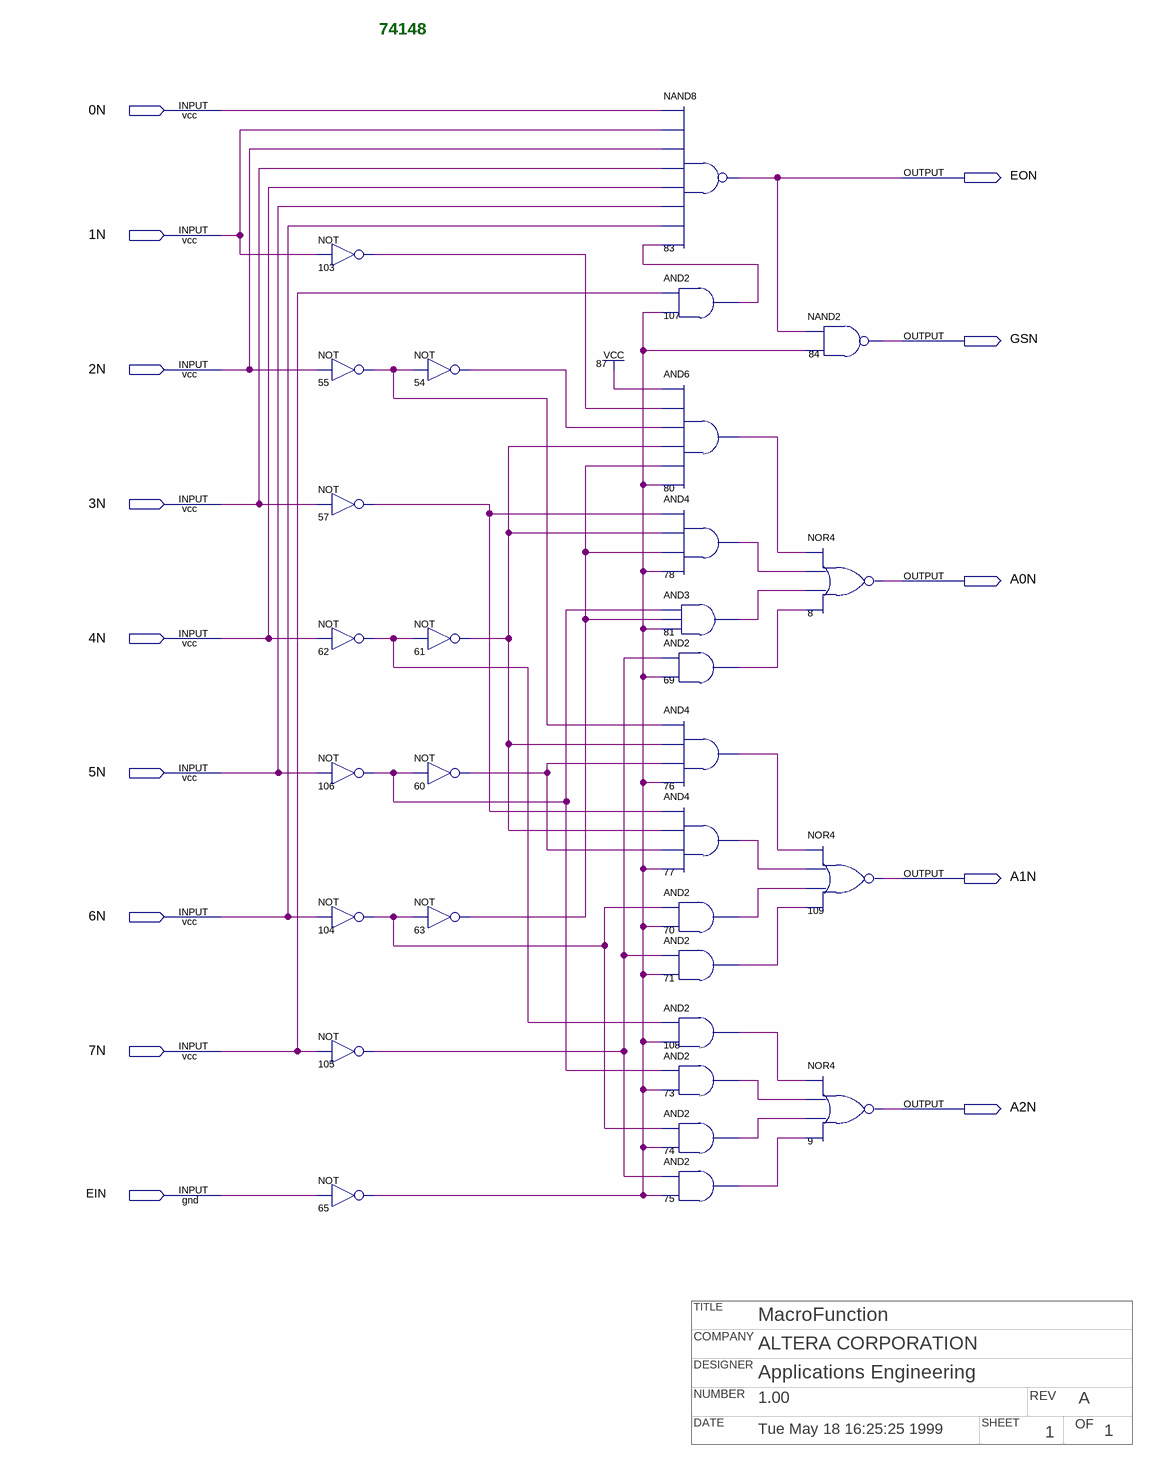
[diagram p0: schematic sheet]
// Quartus schematic 74148.bdf as structural Verilog: 30 symbols, 14 pins
// Title block: TITLE: MacroFunction; COMPANY: ALTERA CORPORATION; DESIGNER: Applications Engineering; NUMBER: 1.00; REV: A; DATE: Tue May 18 16:25:25 1999; SHEET: 1; OF: 1
module \74148  (
  input  \0N ,
  input  \1N ,
  input  \2N ,
  input  \3N ,
  input  \4N ,
  input  \5N ,
  input  \6N ,
  input  \7N ,
  input  EIN,
  output EON,
  output GSN,
  output A0N,
  output A1N,
  output A2N
);

  wire n54_out, n55_out, n57_out, n60_out, n61_out, n62_out, n63_out, n65_out, n69_out, n70_out, n71_out,
       n73_out, n74_out, n75_out, n76_out, n77_out, n78_out, n80_out, n81_out, n103_out, n104_out, n105_out,
       n106_out, n107_out, n108_out;

  not u_103 (n103_out, \1N );
  not u_55 (n55_out, \2N );
  not u_57 (n57_out, \3N );
  not u_62 (n62_out, \4N );
  not u_106 (n106_out, \5N );
  not u_104 (n104_out, \6N );
  not u_105 (n105_out, \7N );
  not u_65 (n65_out, EIN);
  not u_54 (n54_out, n55_out);
  not u_61 (n61_out, n62_out);
  not u_60 (n60_out, n106_out);
  not u_63 (n63_out, n104_out);
  nand u_83 (EON, \0N , \1N , \2N , \3N , \4N , \5N , \6N , n107_out);
  and u_107 (n107_out, \7N , n65_out);
  and u_80 (n80_out, 1'b1, n103_out, n54_out, n61_out, n63_out, n65_out);
  and u_78 (n78_out, n57_out, n61_out, n63_out, n65_out);
  and u_81 (n81_out, n106_out, n63_out, n65_out);
  and u_69 (n69_out, n105_out, n65_out);
  and u_76 (n76_out, n55_out, n61_out, n60_out, n65_out);
  and u_77 (n77_out, n57_out, n61_out, n60_out, n65_out);
  and u_70 (n70_out, n104_out, n65_out);
  and u_71 (n71_out, n105_out, n65_out);
  and u_108 (n108_out, n62_out, n65_out);
  and u_73 (n73_out, n106_out, n65_out);
  and u_74 (n74_out, n104_out, n65_out);
  and u_75 (n75_out, n105_out, n65_out);
  nand u_84 (GSN, EON, n65_out);
  nor u_8 (A0N, n80_out, n78_out, n81_out, n69_out);
  nor u_109 (A1N, n76_out, n77_out, n70_out, n71_out);
  nor u_9 (A2N, n108_out, n73_out, n74_out, n75_out);

  // Notes on the sheet:
  //   74148
endmodule
